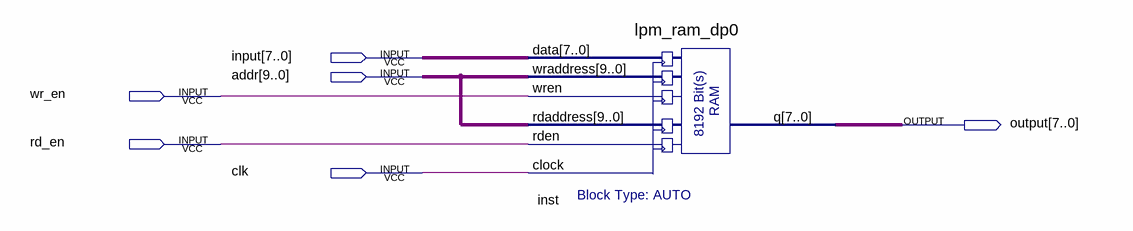
[diagram p0: schematic sheet]
// Quartus schematic StaticRAM_Tester.bdf as structural Verilog: 1 symbols, 6 pins
module StaticRAM_Tester (
  input  [7:0] \input ,
  input  [9:0] addr,
  input  wr_en,
  input  rd_en,
  input  clk,
  output [7:0] \output 
);

  lpm_ram_dp0 inst (
    .data(\input ), .wraddress(addr), .wren(wr_en), .rdaddress(addr), .rden(rd_en), .clock(clk), .q(\output ));
endmodule
